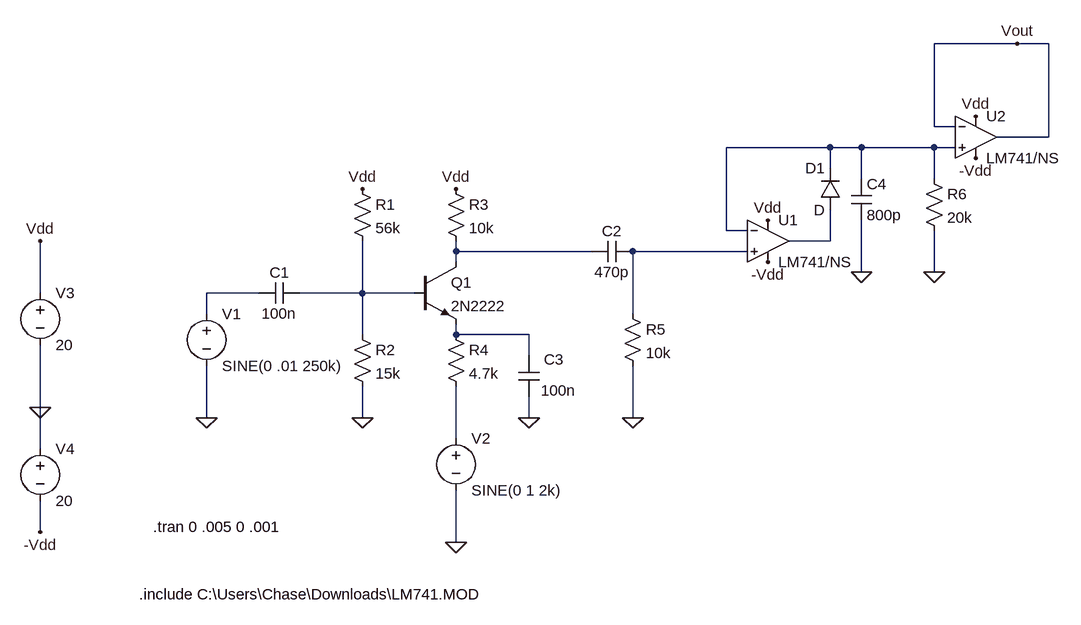
[diagram p0: schematic LAB2bModel.asc]
LAB2bModel.asc, the LTspice schematic file:
Version 4
SHEET 1 1264 680
WIRE 1184 -256 1056 -256
WIRE 1232 -256 1184 -256
WIRE 1056 -128 1056 -256
WIRE 1088 -128 1056 -128
WIRE 1232 -112 1232 -256
WIRE 1232 -112 1152 -112
WIRE 896 -96 736 -96
WIRE 944 -96 896 -96
WIRE 1056 -96 944 -96
WIRE 1088 -96 1056 -96
WIRE 896 -64 896 -96
WIRE 944 -48 944 -96
WIRE 1056 -48 1056 -96
WIRE 736 32 736 -96
WIRE 768 32 736 32
WIRE 896 48 896 0
WIRE 896 48 832 48
WIRE 320 64 320 48
WIRE 528 64 320 64
WIRE 768 64 592 64
WIRE 320 80 320 64
WIRE 944 96 944 16
WIRE 1056 96 1056 32
WIRE -320 128 -320 48
WIRE 16 128 -64 128
WIRE 176 128 176 48
WIRE 176 128 80 128
WIRE 256 128 176 128
WIRE -64 160 -64 128
WIRE 592 160 592 64
WIRE 176 192 176 128
WIRE 320 192 320 176
WIRE 432 192 320 192
WIRE 432 224 432 192
WIRE -320 304 -320 208
WIRE -64 320 -64 240
WIRE 176 320 176 272
WIRE 432 320 432 288
WIRE 592 320 592 240
WIRE 320 352 320 272
WIRE -320 368 -320 304
WIRE -320 496 -320 448
WIRE 320 512 320 432
FLAG 320 512 0
FLAG 432 320 0
FLAG 592 320 0
FLAG 176 320 0
FLAG -64 320 0
FLAG -320 304 0
FLAG -320 48 Vdd
FLAG 176 -32 Vdd
FLAG 320 -32 Vdd
FLAG 944 96 0
FLAG 1056 96 0
FLAG 1184 -256 Vout
FLAG -320 496 -Vdd
FLAG 800 16 Vdd
FLAG 800 80 -Vdd
FLAG 1120 -144 Vdd
FLAG 1120 -80 -Vdd
SYMBOL cap 80 112 R90
WINDOW 0 0 32 VBottom 2
WINDOW 3 32 32 VTop 2
SYMATTR InstName C1
SYMATTR Value 100n
SYMBOL cap 592 48 R90
WINDOW 0 0 32 VBottom 2
WINDOW 3 32 32 VTop 2
SYMATTR InstName C2
SYMATTR Value 470p
SYMBOL cap 448 288 R180
WINDOW 0 -38 58 Left 2
WINDOW 3 -57 10 Left 2
SYMATTR InstName C3
SYMATTR Value 100n
SYMBOL res 160 -48 R0
SYMATTR InstName R1
SYMATTR Value 56k
SYMBOL res 160 176 R0
SYMATTR InstName R2
SYMATTR Value 15k
SYMBOL res 304 -48 R0
SYMATTR InstName R3
SYMATTR Value 10k
SYMBOL res 304 176 R0
SYMATTR InstName R4
SYMATTR Value 4.7k
SYMBOL npn 256 80 R0
SYMATTR InstName Q1
SYMATTR Value 2N2222
SYMBOL res 576 144 R0
SYMATTR InstName R5
SYMATTR Value 10k
SYMBOL voltage -64 144 R0
WINDOW 123 0 0 Left 0
WINDOW 39 0 0 Left 0
SYMATTR InstName V1
SYMATTR Value SINE(0 .01 250k)
SYMBOL voltage 320 336 R0
WINDOW 123 0 0 Left 0
WINDOW 39 0 0 Left 0
SYMATTR InstName V2
SYMATTR Value SINE(0 1 2k)
SYMBOL voltage -320 112 R0
WINDOW 123 0 0 Left 0
WINDOW 39 0 0 Left 0
SYMATTR InstName V3
SYMATTR Value 20
SYMBOL diode 912 0 R180
WINDOW 0 24 64 Left 2
WINDOW 3 24 0 Left 2
SYMATTR InstName D1
SYMBOL res 1040 -64 R0
SYMATTR InstName R6
SYMATTR Value 20k
SYMBOL cap 928 -48 R0
SYMATTR InstName C4
SYMATTR Value 800p
SYMBOL OpAmps\\opamp2 800 -16 R0
SYMATTR InstName U1
SYMATTR Value LM741/NS
SYMBOL OpAmps\\opamp2 1120 -176 R0
SYMATTR InstName U2
SYMATTR Value LM741/NS
SYMBOL voltage -320 352 R0
WINDOW 123 0 0 Left 0
WINDOW 39 0 0 Left 0
SYMATTR InstName V4
SYMATTR Value 20
TEXT -146 488 Left 2 !.tran 0 .005 0 .001
TEXT -168 592 Left 2 !.include C:\\Users\\Chase\\Downloads\\LM741.MOD

The netlist it stands for:
* LAB2bModel.asc
C1 N006 N005 100n
C2 N004 N003 470p
C3 0 N007 100n
R1 Vdd N006 56k
R2 N006 0 15k
R3 Vdd N003 10k
R4 N007 N008 4.7k
Q1 N003 N006 N007 0 2N2222
R5 N004 0 10k
V1 N005 0 SINE(0 .01 250k)
V2 N008 0 SINE(0 1 2k)
V3 Vdd 0 20
D1 N002 N001 D
R6 N001 0 20k
C4 N001 0 800p
XU1 N004 N001 Vdd -Vdd N002 LM741/NS  ; pins In+ In- V+ V- OUT
XU2 N001 Vout Vdd -Vdd Vout LM741/NS  ; pins In+ In- V+ V- OUT
V4 0 -Vdd 20
.model D D
.lib standard.dio
.model NPN NPN
.model PNP PNP
.lib standard.bjt
.tran 0 .005 0 .001
.include C:\Users\Chase\Downloads\LM741.MOD
.backanno
.end